# EasyEDA Pro project STM32_JBL_02.eprj

# Schematic STM32F103C8T6
Create Date: 2024-06-13; Page Name: P1; Project Name: STM32_JBL_02; Schematic Name: STM32F103C8T6; Update Date: 2024-09-14; Company: 帮帮邦邦; Drawed: 电子1214邱振邦; Page Size: A4; Reviewed: 电子1214罗杰华; Version: V1.1
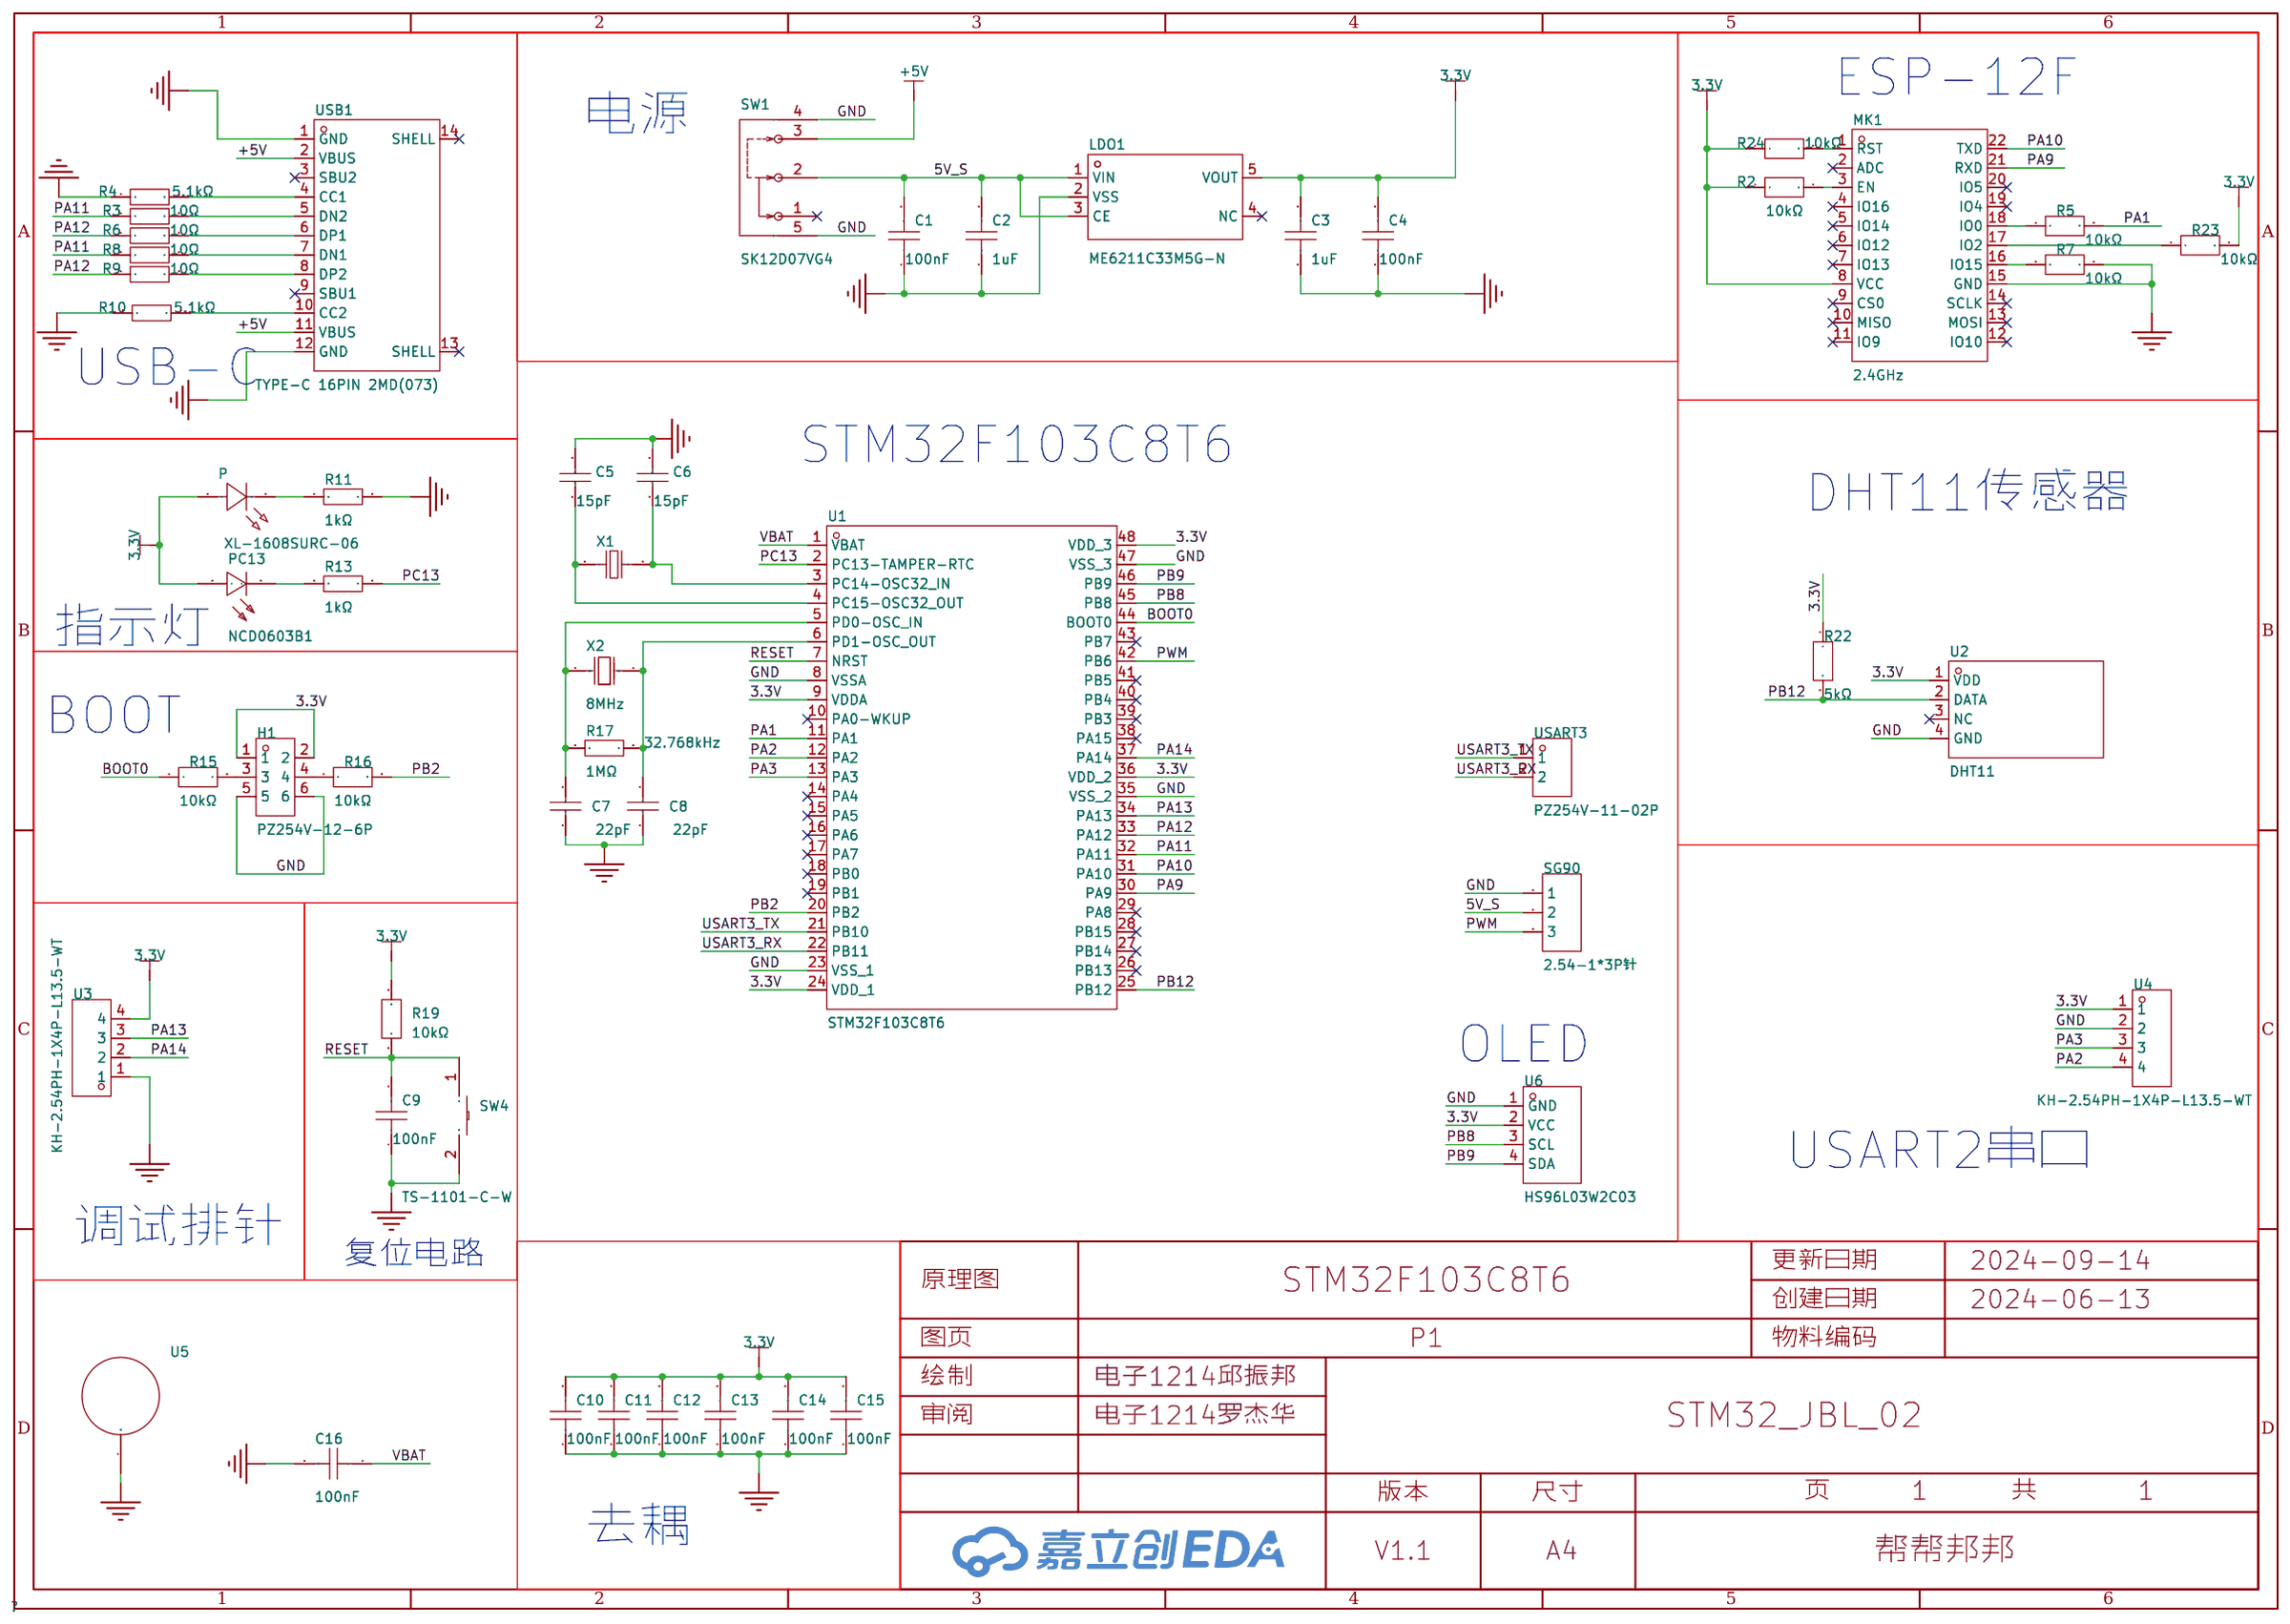
[diagram p0: schematic sheet]

## Parts
C1  100nF  [C0603]
C2  1uF  [C0603]
C3  1uF  [C0603]
C4  100nF  [C0603]
C5  15pF  [C0603]
C6  15pF  [C0603]
C7  22pF  [C0603]
C8  22pF  [C0603]
C9  100nF  [C0603]
C10  100nF  [C0603]
C11  100nF  [C0603]
C12  100nF  [C0603]
C13  100nF  [C0603]
C14  100nF  [C0603]
C15  100nF  [C0603]
C16  100nF  [C0603]
H1  PZ254V-12-6P  [HDR-TH_6P-P2.54-V-M-R2-C3-S2.54]
LDO1  ME6211C33M5G-N  [SOT-23-5_L3.0-W1.7-P0.95-LS2.8-BL]
MK1  2.4GHz  [WIFIM-SMD_ESP-12E-BR]
P  XL-1608SURC-06  [LED0603-RD_RED]
PC13  NCD0603B1  [LED0603-RD]
R2  10kΩ  [R0603]
R3  10Ω  [R0603]
R4  5.1kΩ  [R0603]
R5  10kΩ  [R0603]
R6  10Ω  [R0603]
R7  10kΩ  [R0603]
R8  10Ω  [R0603]
R9  10Ω  [R0603]
R10  5.1kΩ  [R0603]
R11  1kΩ  [R0603]
R13  1kΩ  [R0603]
R15  10kΩ  [R0603]
R16  10kΩ  [R0603]
R17  1MΩ  [R0603]
R19  10kΩ  [R0603]
R22  5kΩ  [R0805]
R23  10kΩ  [R0603]
R24  10kΩ  [R0603]
SG90  2.54-1*3P针  [HDR-TH_3P-P2.54-V-M-1]
SW1  SK12D07VG4  [SW-TH_SK12D07VG4]
SW4  TS-1101-C-W  [SW-SMD_L6.0-W3.3-LS8.0]
U1  STM32F103C8T6  [LQFP-48_L7.0-W7.0-P0.50-LS9.0-BL]
U2  DHT11  [SENSOR-TH_DHT11]
U3  KH-2.54PH-1X4P-L13.5-WT  [HDR-SMD_4P-P2.54-H-M-W13.3-N]
U4  KH-2.54PH-1X4P-L13.5-WT  [HDR-SMD_4P-P2.54-H-M-W13.3-N]
U5  -  [定位孔]
U6  HS96L03W2C03  [OLED-TH_L27.8-W27.2-P2.54_C9900033791]
USART3  PZ254V-11-02P  [HDR-TH_2P-P2.54-V-M]
USB1  TYPE-C 16PIN 2MD(073)  [USB-C-SMD_TYPE-C-6PIN-2MD-073]
X1  32.768kHz  [FC-135R_L3.2-W1.5]
X2  8MHz  [CRYSTAL-SMD_L11.5-W4.8-LS12.7]

## Library data of the parts
C1 C4 C9-C16 = CC0603KRX7R9BB104: 容值:100nF;精度:±10%;额定电压:50V;材质(温度系数):X7R;; LCSC Part Name: 100nF ±10% 50V; Supplier Part: C14663; Manufacturer: YAGEO(国巨); Supplier Footprint: 0603; JLCPCB Part Class: Basic Part; Datasheet: https://atta.szlcsc.com/upload/public/pdf/source/20180910/C282072_33301C7F631E79921B82A8DAC6BCC5B3.pdf; Supplier: LCSC; Tolerance: ±10%; Voltage Rated: 50V; Temperature Coefficient: X7R
C2 C3 = CL10A105KB8NNNC: 容值:1uF;精度:±10%;额定电压:50V;材质(温度系数):X5R;; LCSC Part Name: 1uF ±10% 50V; Supplier Part: C15849; Manufacturer: SAMSUNG(三星); Supplier Footprint: 0603; JLCPCB Part Class: Basic Part; Datasheet: https://atta.szlcsc.com/upload/public/pdf/source/20160218/1457707763339.pdf; Supplier: LCSC; Tolerance: ±10%; Voltage Rated: 50V; Temperature Coefficient: X5R
C5 C6 = CL10C150JB8NNNC: 容值:15pF;精度:±5%;额定电压:50V;材质(温度系数):C0G;; LCSC Part Name: 15pF ±5% 50V; Supplier Part: C1644; Manufacturer: SAMSUNG(三星); Supplier Footprint: 0603; JLCPCB Part Class: Basic Part; Datasheet: https://atta.szlcsc.com/upload/public/pdf/source/20160218/1457707763339.pdf; Supplier: LCSC; Tolerance: ±5%; Voltage Rated: 50V; Temperature Coefficient: C0G
C7 C8 = CC0603JRNPO9BN220: 容值:22pF;精度:±5%;额定电压:50V;材质(温度系数):NP0;; LCSC Part Name: 22pF ±5% 50V; Supplier Part: C105620; Manufacturer: YAGEO(国巨); Supplier Footprint: 0603; JLCPCB Part Class: Extended Part; Datasheet: https://atta.szlcsc.com/upload/public/pdf/source/20170505/1493957838062.pdf; Supplier: LCSC; Tolerance: ±5%; Voltage Rated: 50V; Temperature Coefficient: NP0
H1 = PZ254V-12-6P: 插针结构:2x3P;间距:2.54mm;行距:2.54mm;圆针/方针:方针;安装类型:直插;排数:双排;总PIN位数:6P;额定电流:-;额定电压:-;配合针长度:6mm;塑高:2.5mm;端接针长度:3mm;触头材质:黄铜;触头镀层:-;工作温度范围:-40℃~+105℃;颜色:黑色;; LCSC Part Name: 间距:2.54mm 2x3P 直插 方针; Supplier Part: C492420; Manufacturer: XFCN(兴飞); Supplier Footprint: 插件,P=2.54mm; JLCPCB Part Class: Extended Part; Datasheet: https://atta.szlcsc.com/upload/public/pdf/source/20200309/C492420_BAECB307B001054C09D200388220EAE6.pdf; Supplier: LCSC; Pin Structure: 2x3P; Pitch: 2.54mm; Row Spacing: 2.54mm; Circluar Pins/Square Pins: 方针; Mounting Type: 直插; Number of Rows: 双排; Number of Pins: 6P; Length of Mating Pin: 6mm; Insulation Height: 2.5mm; Length of End Connection Pin: 3mm; Contact Material: 黄铜; Operating Temperature Range: -40℃~+105℃; Color: 黑色
LDO1 = ME6211C33M5G-N: 输出类型:固定;最大输入电压:6V;输出电压:3.3V;最大输出电流:500mA;电源纹波抑制比(PSRR):70dB;输出极性:正极;; LCSC Part Name: 输入6V 输出3.3V 500mA; Supplier Part: C82942; Manufacturer: MICRONE(南京微盟); Supplier Footprint: SOT-23-5; JLCPCB Part Class: Extended Part; Datasheet: https://atta.szlcsc.com/upload/public/pdf/source/20170918/C82942_1505727073070976520.pdf; Supplier: LCSC; Output Type: 固定; Maximum Input Voltage: 6V; Output Voltage: 3.3V; MAX Output Current: 500mA; Power Supply Rejection Ratio (PSRR): 70dB; Dropout Voltage: 260mV@(200mA); Output Polarity: 正极; Number of Outputs: 1
MK1 = ESP-12E_C89297: 核心处理器:ESP8266芯片;频率:2.4GHz;天线形式:板载PCB天线;发射功率:16dBm;接收灵敏度:-90dBm;; LCSC Part Name: 完整的802.11b/g/nWi-FiSoC模块; Supplier Part: C89297; Manufacturer: Ai-Thinker(安信可); Manufacturer Part: ESP-12E; Supplier Footprint: SMD,16x24mm; JLCPCB Part Class: Extended Part; Datasheet: https://atta.szlcsc.com/upload/public/pdf/source/20200309/C89297_977B32CC0B44EF42A21CAAFB43B2575A.pdf; Supplier: LCSC; Core Processor: ESP8266芯片; Support Interface: GPIO；UART；I2C；PWM；SPI；ADC; Antenna Type: 板载PCB天线; Output Power: 16dBm; Operating Voltage: 3V~3.6V; Receive  Current: 56mA; Send  Current: 170mA; Sensitivity: -90dBm; Operating Temperature: -20℃~+70℃
P = XL-1608SURC-06: 发光颜色:红色;功率:55mW;正向电流:25mA;主波长:617nm~621nm;透镜颜色:无色透明透镜;色温:-;发光角度:120°;载带方式:正贴;工作温度:-30℃~+85℃;; Supplier Part: C965799; Manufacturer: XINGLIGHT(成兴光); Supplier Footprint: 0603; JLCPCB Part Class: Extended Part; Datasheet: https://atta.szlcsc.com/upload/public/pdf/source/20221102/D860AFDD1CDB02C5A8064103A32707E2.pdf; Supplier: LCSC; Emitted Color: 红色; Power Dissipation: 55mW; Forward Current: 25mA; Dominant Wavelength: 617nm~621nm; Peak Wavelength: 623nm; Lens Color: 无色透明透镜; Viewing Angle: 120°; Mounting Sytle: 正贴; Operating Temperature: -30℃~+85℃
PC13 = NCD0603B1: 发光颜色:蓝色;正向电压(VF):2.6V~3.6V;功率:72mW;正向电流:10mA;主波长:463nm~475nm;透镜颜色:无色透明透镜;发光强度:80mcd~220mcd;发光角度:130°;工作温度:-30℃~+85℃;; Supplier Part: C84266; Manufacturer: 国星光电; Supplier Footprint: 0603; JLCPCB Part Class: 扩展库; Datasheet: https://atta.szlcsc.com/upload/public/pdf/source/20200820/C84266_6A3CDBEFA72C6CAD68EDA53474ADAE6C.pdf; Supplier: LCSC; Emitted Color: 蓝色; Forward Voltage (VF): 2.6V~3.6V; Power Dissipation: 72mW; Forward Current: 10mA; Dominant Wavelength: 463nm~475nm; Lens Color: 无色透明透镜; Luminous Intensity: 80mcd~220mcd; Viewing Angle: 130°; Operating Temperature: -30℃~+85℃
R2 R5 R7 R15 R16 R19 R23 R24 = FRC0603J103TS: 电阻类型:厚膜电阻;阻值:10kΩ;精度:±5%;功率:100mW;最大工作电压:75V;温度系数:±100ppm/℃;; LCSC Part Name: 10kΩ ±5% 100mW 厚膜电阻; Supplier Part: C2930027; Manufacturer: FOJAN(富捷); Supplier Footprint: 0603; JLCPCB Part Class: Extended Part; Datasheet: https://atta.szlcsc.com/upload/public/pdf/source/20211221/925EC7D7225764EE0046F22065062C87.pdf; Supplier: LCSC; Type: 厚膜电阻; Tolerance: ±5%; Power(Watts): 100mW; Overload Voltage (Max): 75V; Temperature Coefficient: ±100ppm/℃; Operating Temperature Range: -55℃~+155℃
R3 R6 R8 R9 = 0603WAF100JT5E: 电阻类型:厚膜电阻;阻值:10Ω;精度:±1%;功率:100mW;最大工作电压:75V;温度系数:±400ppm/℃;; LCSC Part Name: 10Ω ±1% 100mW 厚膜电阻; Supplier Part: C22859; Manufacturer: UNI-ROYAL(厚声); Supplier Footprint: 0603; JLCPCB Part Class: Basic Part; Datasheet: https://atta.szlcsc.com/upload/public/pdf/source/20200306/C422600_1E6D84923E4A46A82E41ADD87F860B5C.pdf; Supplier: LCSC; Type: 厚膜电阻; Tolerance: ±1%; Power(Watts): 100mW; Overload Voltage (Max): 75V; Temperature Coefficient: ±400ppm/℃; Operating Temperature Range: -55℃~+155℃
R4 R10 = 0603WAF5101T5E: 电阻类型:厚膜电阻;阻值:5.1kΩ;精度:±1%;功率:100mW;最大工作电压:75V;温度系数:±100ppm/℃;; LCSC Part Name: 5.1kΩ ±1% 100mW 厚膜电阻; Supplier Part: C23186; Manufacturer: UNI-ROYAL(厚声); Supplier Footprint: 0603; JLCPCB Part Class: Basic Part; Datasheet: https://atta.szlcsc.com/upload/public/pdf/source/20200306/C422600_1E6D84923E4A46A82E41ADD87F860B5C.pdf; Supplier: LCSC; Type: 厚膜电阻; Tolerance: ±1%; Power(Watts): 100mW; Overload Voltage (Max): 75V; Temperature Coefficient: ±100ppm/℃; Operating Temperature Range: -55℃~+155℃
R11 R13 = RC0603FR-071KL: 电阻类型:厚膜电阻;阻值:1kΩ;精度:±1%;功率:100mW;最大工作电压:75V;温度系数:±100ppm/℃;; LCSC Part Name: 厚膜电阻 1kΩ ±1% 100mW; Supplier Part: C22548; Manufacturer: YAGEO(国巨); Supplier Footprint: 0603; JLCPCB Part Class: Extended Part; Datasheet: https://atta.szlcsc.com/upload/public/pdf/source/20180316/70C0E2BDAE7FCC62C531A5A58D202EE1.pdf; Supplier: LCSC; Type: 厚膜电阻; Tolerance: ±1%; Power(Watts): 100mW; Overload Voltage (Max): 75V; Temperature Coefficient: ±100ppm/℃; Operating Temperature Range: -55℃~+155℃
R17 = 0603WAF1004T5E: 电阻类型:厚膜电阻;阻值:1MΩ;精度:±1%;功率:100mW;最大工作电压:75V;温度系数:±100ppm/℃;; LCSC Part Name: 1MΩ ±1% 100mW 厚膜电阻; Supplier Part: C22935; Manufacturer: UNI-ROYAL(厚声); Supplier Footprint: 0603; JLCPCB Part Class: Basic Part; Datasheet: https://atta.szlcsc.com/upload/public/pdf/source/20200306/C422600_1E6D84923E4A46A82E41ADD87F860B5C.pdf; Supplier: LCSC; Type: 厚膜电阻; Tolerance: ±1%; Power(Watts): 100mW; Overload Voltage (Max): 75V; Temperature Coefficient: ±100ppm/℃; Operating Temperature Range: -55℃~+155℃
R22 = ARG05BTC5001N: 电阻类型:薄膜电阻;阻值:5kΩ;精度:±0.1%;功率:125mW;最大工作电压:150V;温度系数:±25ppm/℃;; LCSC Part Name: 薄膜电阻 5kΩ ±0.1% 125mW; Supplier Part: C2828700; Manufacturer: Viking(光颉); Supplier Footprint: 0805; JLCPCB Part Class: Extended Part; Datasheet: https://atta.szlcsc.com/upload/public/pdf/source/20190816/C412422_E173BA386C6DD8245B6A88358EF9877A.pdf; Supplier: LCSC; Type: 薄膜电阻; Tolerance: ±0.1%; Power(Watts): 125mW; Overload Voltage (Max): 150V; Temperature Coefficient: ±25ppm/℃; Operating Temperature Range: -55℃~+155℃
SG90 = 2.54-1*3P针: 插针结构:1x3P;间距:2.54mm;行距:-;圆针/方针:方针;安装类型:直插;排数:单排;总PIN位数:3P;额定电流:3A;额定电压:-;配合针长度:-;塑高:-;端接针长度:-;触头材质:-;触头镀层:-;工作温度范围:-40℃~+105℃;颜色:黑色;; LCSC Part Name: 间距:2.54mm 1x3P 直插 方针; Supplier Part: C49257; Manufacturer: BOOMELE(博穆精密); Supplier Footprint: 插件,P=2.54mm; JLCPCB Part Class: 扩展库; Datasheet: https://atta.szlcsc.com/upload/public/pdf/source/20221018/3E9408392E35E6F57A28985E5F7BF5C9.pdf; Supplier: LCSC; Pin Structure: 1x3P; Pitch: 2.54mm; Circluar Pins/Square Pins: 方针; Mounting Type: 直插; Number of Rows: 单排; Number of Pins: 3P; Current Rating (Max): 3A; Operating Temperature Range: -40℃~+105℃; Color: 黑色
SW1 = SK12D07VG4: 电路结构:单刀双掷;安装方式:-;额定电流(DC):500mA;额定电压(DC):50V;额定电流(AC):-;额定电压(AC):-;机械寿命:5千次;; LCSC Part Name: 3脚2档位 卧插 滑动开关; Supplier Part: C393937; Manufacturer: SHOU HAN(首韩); Supplier Footprint: 插件; JLCPCB Part Class: Extended Part; Datasheet: https://atta.szlcsc.com/upload/public/pdf/source/20190521/C393937_939FE26E571CC67D2D532E953108A1B0.pdf; Supplier: LCSC; Circuit: 单刀双掷; Actuator Style: 矩形柱状; Pin Style: PC引脚; Switch Height: 8.8mm; Current Rating (DC): 500mA; Voltage Rating (DC): 50V; Mechanical Life: 5千次
SW4 = TS-1101-C-W: 电路结构:单刀单掷;按钮形状:矩形按钮;作用力:260gf;安装方式:立贴;开关长度:6mm;开关宽度:3.6mm;开关高度:2.5mm;带支架:不带;触点电流:50mA;额定电压(AC):-;额定电压(DC):12V;额定功率:-;绝缘电阻:-;带灯:无;机械寿命:5万次;; LCSC Part Name: 6*3.6*2.5mm 立贴 轻触开关; Supplier Part: C318938; Manufacturer: XKB Connectivity(中国星坤); Supplier Footprint: SMD; JLCPCB Part Class: Extended Part; Datasheet: https://atta.szlcsc.com/upload/public/pdf/source/20200227/C318938_C2E53B1EEDE37D980A33616AC086DE53.pdf; Supplier: LCSC; Circuit: 单刀单掷; Actuator Style: 矩形按钮; Operating Force: 260gf; Mounting Style: 立贴; Switch Length: 6mm; Switch Width: 3.6mm; Switch Height: 2.5mm; Strike Gundam: 不带; Contact Current: 50mA; Voltage Rating (DC): 12V; Actuator/Cap Color: 白色带淡绿; With Lamp: 无; Mechanical Life: 5万次; Operating Temperature: -30℃~+85℃
U1 = STM32F103C8T6: CPU内核:ARM-M3;程序存储容量:64KB;RAM总容量:20KB;GPIO端口数量:37;工作电压范围:2V~3.6V;CPU最大主频:72MHz;程序存储器类型:FLASH;; Supplier Part: C8734; Manufacturer: ST(意法半导体); Supplier Footprint: LQFP-48(7x7); JLCPCB Part Class: Extended Part; Datasheet: https://atta.szlcsc.com/upload/public/pdf/source/20220812/8363ACEC51AD55ECEB84799464F7CB85.pdf; Supplier: LCSC; CPU Core: ARM-M3; Program Storage Size: 64KB; RAM Size: 20KB; GPIO Ports Number: 37; Operating Voltage Range: 2V~3.6V; CPU Maximum Speed: 72MHz; Program Memory Type: FLASH; Operating Temperature Range: -40℃~+85℃; ADC (Bit): 12bit; Universal Serial Bus: 有; Peripheral/Function: 看门狗；DMA；看门狗；温度传感器; Watchdog: 有; Infrared Data Association: 有; Low-Voltage Detect: 有; Direct Memory Access: 有; Internal Oscillator: 有
U2 = DHT11: 新款电容式数字温湿度传感器,老款已停产16.1x12.6x5.8mm; LCSC Part Name: DHT11  电容式传感器; Supplier Part: C117051; Manufacturer: 广州奥松; Supplier Footprint: SIP-4; JLCPCB Part Class: Extended Part; Datasheet: https://atta.szlcsc.com/upload/public/pdf/source/20170703/1499081238365.pdf; Supplier: LCSC
U3 U4 = KH-2.54PH-1X4P-L13.5-WT: 插针结构:1x4P;间距:2.54mm;安装类型:卧贴;排数:单排;; LCSC Part Name: 1x4P 间距:2.54mm 卧贴; Supplier Part: C20610213; Manufacturer: kinghelm(金航标); Supplier Footprint: SMD,P=2.54mm,卧贴; JLCPCB Part Class: Extended Part; Datasheet: https://atta.szlcsc.com/upload/public/pdf/source/20240117/0E03F58DBD0D2B730423A71148A2974D.pdf; Supplier: LCSC; Pin Structure: 1x4P; Pitch: 2.54mm; Mounting Type: 卧贴; Number of Rows: 单排
U5 = 定位孔
U6 = HS96L03W2C03: 主控芯片:SSD1315;接口类型:I2C;尺寸(inch):0.96;像素分辨率:128x64;; LCSC Part Name: 0.96寸OLED显示屏窄白光IIC; Supplier Part: C5248080; Manufacturer: HS(汉昇); JLCPCB Part Class: 扩展库; Datasheet: https://atta.szlcsc.com/upload/public/pdf/source/20230627/763D01F79A90007632F098068C7C8AD9.pdf; Supplier: LCSC; Main Control Chip: SSD1315; Interface Type: I2C; Size: 0.96; Pixel Resolution: 128x64; Operating Temperature: -40℃~+70℃
USART3 = PZ254V-11-02P: 插针结构:1x2P;间距:2.54mm;行距:-;圆针/方针:方针;安装类型:直插;排数:单排;总PIN位数:2P;额定电流:-;额定电压:-;配合针长度:6mm;塑高:2.5mm;端接针长度:3mm;触头材质:黄铜;触头镀层:-;工作温度范围:-40℃~+105℃;颜色:黑色;; LCSC Part Name: 间距:2.54mm 1x2P 直插 方针; Supplier Part: C492401; Manufacturer: XFCN(兴飞); Supplier Footprint: 插件,P=2.54mm; JLCPCB Part Class: 扩展库; Datasheet: https://atta.szlcsc.com/upload/public/pdf/source/20200309/C492401_A812433581A9B211A7FFA413ADDFF0E5.pdf; Supplier: LCSC; Pin Structure: 1x2P; Pitch: 2.54mm; Circluar Pins/Square Pins: 方针; Mounting Type: 直插; Number of Rows: 单排; Number of Pins: 2P; Length of Mating Pin: 6mm; Insulation Height: 2.5mm; Length of End Connection Pin: 3mm; Contact Material: 黄铜; Operating Temperature Range: -40℃~+105℃; Color: 黑色
USB1 = TYPE-C 16PIN 2MD(073): 连接器类型:Type-C;标准:-;公母:母;端口数量:1;触点数量:16P;安装方式:卧贴;额定电流 - 电源:5A;工作温度范围:-25℃~+85℃;; LCSC Part Name: Type-C 母 卧贴; Supplier Part: C2765186; Manufacturer: SHOU HAN(首韩); Supplier Footprint: SMD; JLCPCB Part Class: Extended Part; Datasheet: https://atta.szlcsc.com/upload/public/pdf/source/20211123/39B17C16241EAC15C5E277BDA434118E.pdf; Supplier: LCSC; Connector Type: Type-C; Gender: 母; Number of Ports: 1; Number of Contacts: 16P; Mounting Style: 卧贴; Current Rating - Power (Max): 5A; Operating Temperature Range: -25℃~+85℃
X1 = Q13FC13500004_C32346: 晶振类型:贴片晶振;频率:32.768kHz;常温频差:±20ppm;外接负载电容:12.5pF;; LCSC Part Name: 32.768kHz ±20ppm 12.5pF; Supplier Part: C32346; Manufacturer: EPSON(爱普生); Manufacturer Part: Q13FC13500004; Supplier Footprint: SMD3215-2P; JLCPCB Part Class: Basic Part; Datasheet: https://atta.szlcsc.com/upload/public/pdf/source/20240418/0E0FF5F0356BA3753F616001439D1416.pdf; Supplier: LCSC; Crystal Type: 贴片晶振; Normal temperature Frequency Tolerance: ±20ppm; External load capacitor: 12.5pF; Equivalent Series Resistance (ESR): 70kΩ; Operating Temperature: -40℃~+85℃
X2 = X49SM8MSD2SC: 晶振类型:贴片晶振;频率:8MHz;常温频差:±20ppm;外接负载电容:20pF;频率稳定度(全温):±30ppm;; LCSC Part Name: 8MHz ±20ppm 20pF; Supplier Part: C12674; Manufacturer: YXC(扬兴晶振); Supplier Footprint: HC-49S-SMD; JLCPCB Part Class: Basic Part; Datasheet: https://atta.szlcsc.com/upload/public/pdf/source/20240329/3EBF42EBCAB50CA65B6FA9D7CFA1955A.pdf; Supplier: LCSC; Crystal Type: 贴片晶振; Normal temperature Frequency Tolerance: ±20ppm; External load capacitor: 20pF; Frequency Stability(Full temperature range): ±30ppm; Operating Temperature: -20℃~+70℃

## Nets
3.3V: C3.2 C4.2 C10.2 C11.2 C12.2 C13.2 C14.2 C15.2 H1.1 H1.2 LDO1.5(VOUT) MK1.8(VCC) P.2(A) PC13.2(+) R2.1 R19.2 R22.1 R23.2 R24.1 U1.9(VDDA) U1.24(VDD_1) U1.36(VDD_2) U1.48(VDD_3) U2.1(VDD) U3.4 U4.1 U6.2(VCC)
5V_S: C1.2 C2.2 LDO1.1(VIN) LDO1.3(CE) SG90.2 SW1.2
+5V: SW1.3 USB1.2(VBUS) USB1.11(VBUS)
GND: C1.1 C2.1 C3.1 C4.1 C5.2 C6.2 C7.1 C8.1 C9.1 C10.1 C11.1 C12.1 C13.1 C14.1 C15.1 C16.2 H1.5 H1.6 LDO1.2(VSS) MK1.15(GND) R4.1 R7.2 R10.1 R11.2 SG90.1 SW1.4 SW1.5 SW4.2 U1.8(VSSA) U1.23(VSS_1) U1.35(VSS_2) U1.47(VSS_3) U2.4(GND) U3.1 U4.2 U5.1(GND) U6.1(GND) USB1.1(GND) USB1.12(GND)
VBAT: C16.1 U1.1(VBAT)
BOOT0: R15.1 U1.44(BOOT0)
PA1: R5.2 U1.11(PA1)
PA2: U1.12(PA2) U4.4
PA3: U1.13(PA3) U4.3
PA9: MK1.21(RXD) U1.30(PA9)
PA10: MK1.22(TXD) U1.31(PA10)
PA11: R3.1 R8.1 U1.32(PA11)
PA12: R6.1 R9.1 U1.33(PA12)
PA13: U1.34(PA13) U3.3
PA14: U1.37(PA14) U3.2
PB2: R16.2 U1.20(PB2)
PB8: U1.45(PB8) U6.3(SCL)
PB9: U1.46(PB9) U6.4(SDA)
PB12: R22.2 U1.25(PB12) U2.2(DATA)
PC13: R13.2 U1.2(PC13-TAMPER-RTC)
PWM: SG90.3 U1.42(PB6)
RESET: C9.2 R19.1 SW4.1 U1.7(NRST)
USART3_RX: U1.22(PB11) USART3.2
USART3_TX: U1.21(PB10) USART3.1
$1N1630: MK1.3(EN) R2.2
$1N3315: C5.1 U1.4(PC15-OSC32_OUT) X1.2
$1N3359: C6.1 U1.3(PC14-OSC32_IN) X1.1
$1N3671: C7.2 R17.1 U1.5(PD0-OSC_IN) X2.1(OSC1)
$1N3708: C8.2 R17.2 U1.6(PD1-OSC_OUT) X2.2(OSC2)
$1N7553: R3.2 USB1.5(DN2)
$1N7577: R6.2 USB1.6(DP1)
$1N7601: R8.2 USB1.7(DN1)
$1N7625: R9.2 USB1.8(DP2)
$1N15087: P.1(K) R11.1
$1N15121: PC13.1(-) R13.1
$1N18837: R10.2 USB1.10(CC2)
$1N26698: MK1.16(IO15) R7.1
$1N35712: R4.2 USB1.4(CC1)
$1N52179: MK1.18(IO0) R5.1
$1N52203: MK1.17(IO2) R23.1
$1N63834: MK1.1(RST) R24.2
$1N65356: H1.4 R16.1
$1N65358: H1.3 R15.2

Not connected (* = marked no-connect by the designer): LDO1 4(NC)*; MK1 2(ADC)* 4(IO16)* 5(IO14)* 6(IO12)* 7(IO13)* 9(CS0)* 10(MISO)* 11(IO9)* 12(IO10)* 13(MOSI)* 14(SCLK)* 19(IO4)* 20(IO5)*; SW1 1*; U1 10(PA0-WKUP)* 14(PA4)* 15(PA5)* 16(PA6)* 17(PA7)* 18(PB0)* 19(PB1)* 26(PB13)* 27(PB14)* 28(PB15)* 29(PA8)* 38(PA15)* 39(PB3)* 40(PB4)* 41(PB5)* 43(PB7)*; U2 3(NC)*; USB1 3(SBU2)* 9(SBU1)* 13(SHELL)* 14(SHELL)*

## Notes on the sheet
- ESP-12F
- 电源
- USB-C
- STM32F103C8T6
- DHT11传感器
- 指示灯
- BOOT
- OLED
- USART2串口
- 调试排针
- 复位电路
- 去耦

# Board PCB2
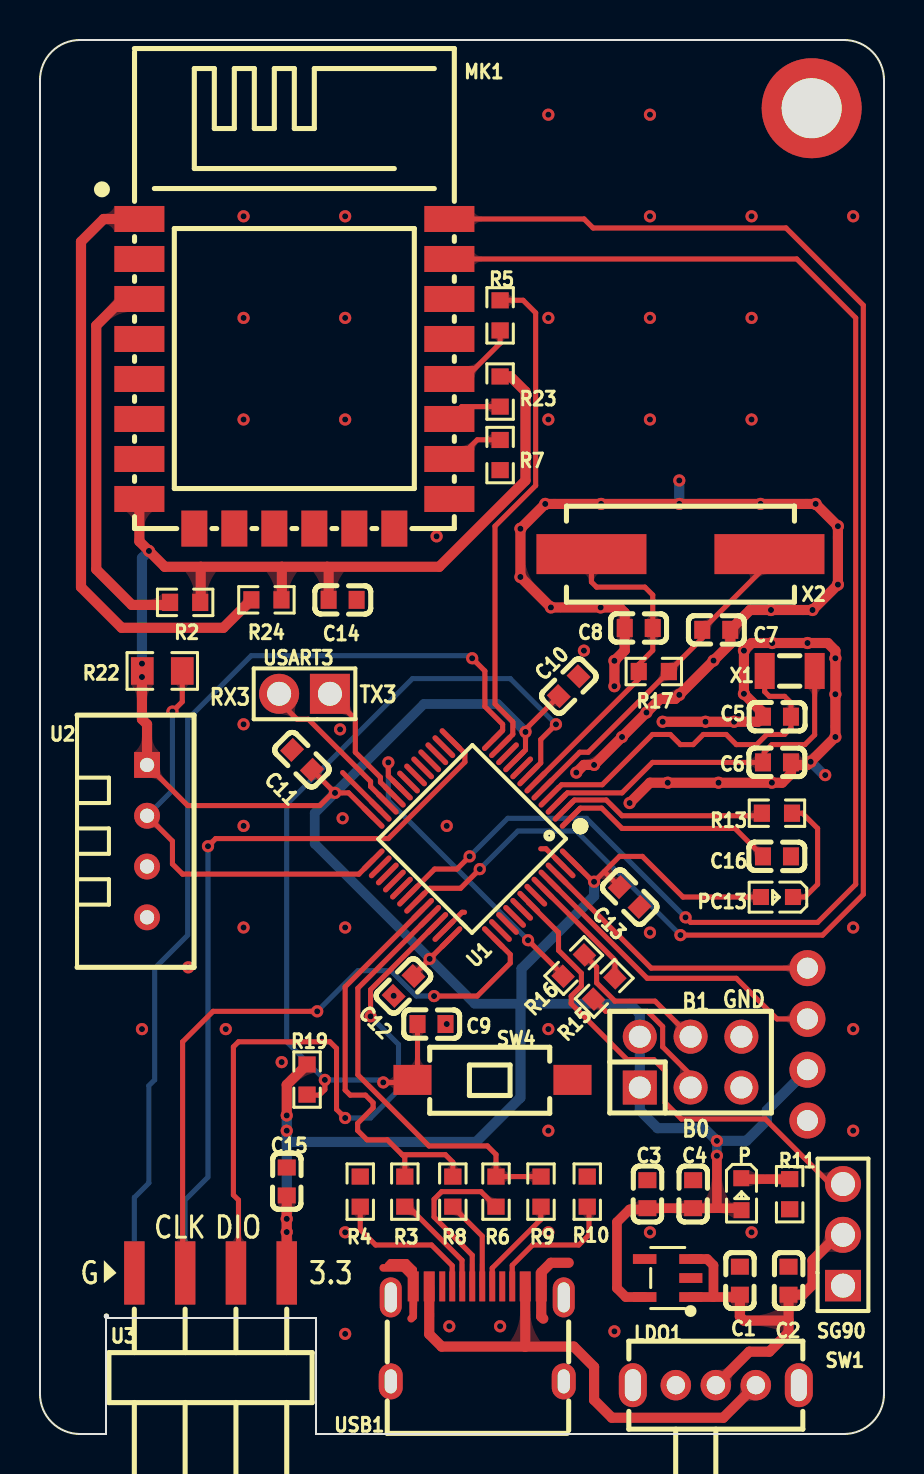
[diagram p1: board, top side]
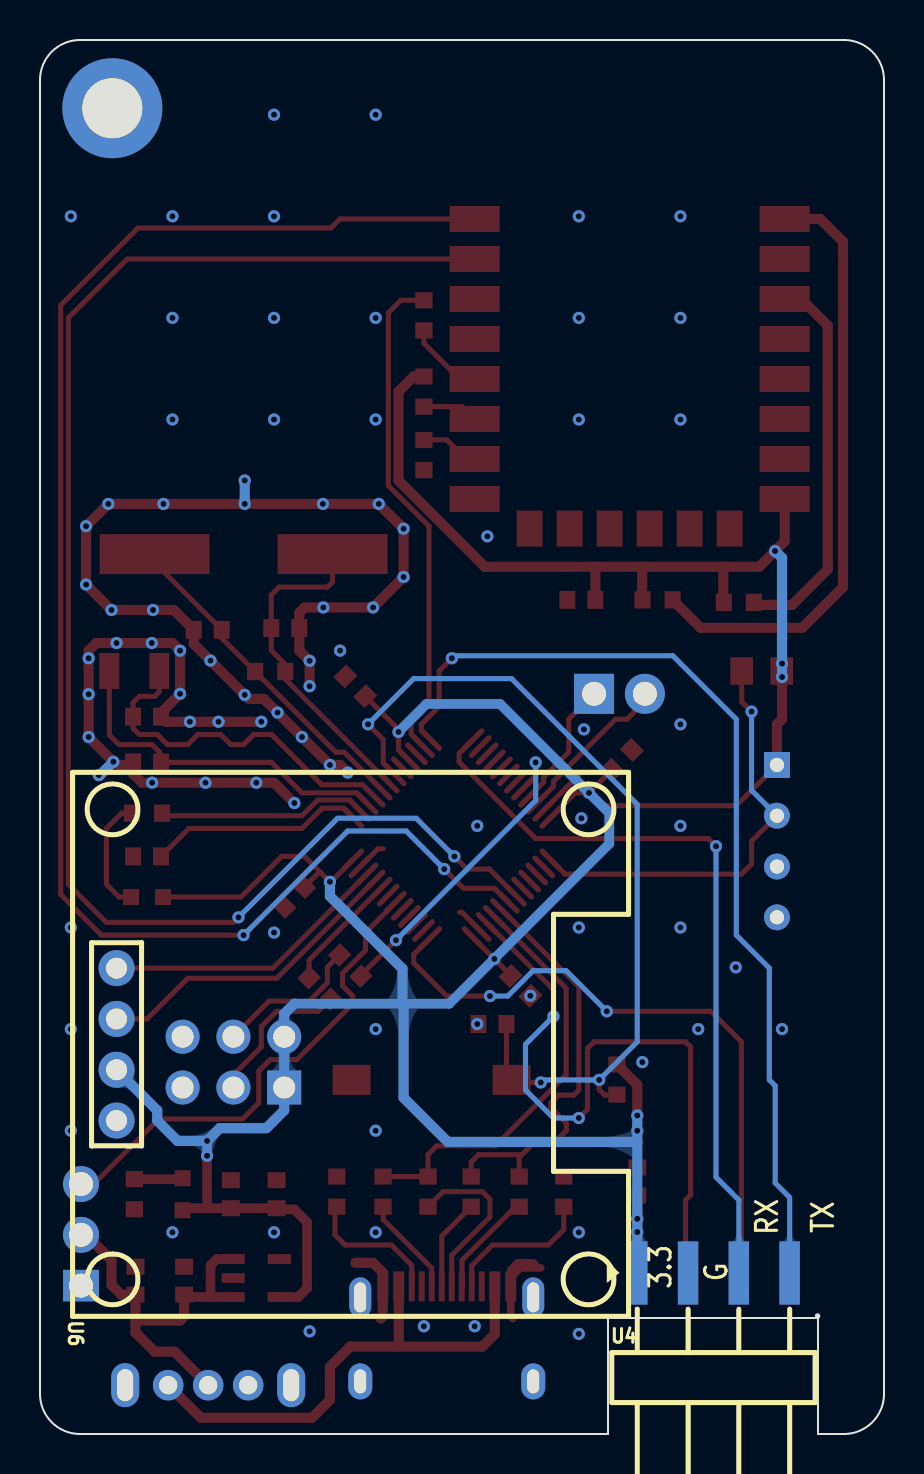
[diagram p2: board, bottom side, seen from below]

Outline 42.2 x 69.7 mm; copper layers: Top Layer, Bottom Layer. Coordinates in mm from the lower left corner of the outline.
Outline path: 3.3,2 3.3,0 ; 3.3,0 2,0 arc(0.59,0.59) 0,2 0,67.7 arc(0.59,69.11) 2,69.7 40.2,69.7 arc(41.61,69.11) 42.2,67.7 42.2,2 arc(41.61,0.59) 40.2,0 13.8,0 ; 3.3,0 3.3,5.8 13.8,5.8 13.8,0 ; 13.8,0 13.8,2 ; 3.32,5.89 3.32,5.89 3.33,5.89 3.32,5.89
Stack: Top Layer 0.035mm / Dielectric1 1.51mm FR4 er 4.5 / Bottom Layer 0.035mm

## Design rules (mm)
template: JLCPCB Capability(Two Layers Board)
spacing copperThickness1oz (default): track to track 0.102, other pairs 0.152 to 0.3
spacing copperThickness2oz: track to track 0.203, other pairs 0.152 to 0.3
track width copperThickness1oz (default): min 0.127, default 0.254, max 2.54
track width copperThickness2oz: min 0.203, default 0.254, max 2.54
differential pair differentialPair (default): width min 0.127, default 0.254, max 2.54; gap min 0.152, default 0.152
via viaSize (default): diameter min 0.5, default 0.61, max 10; hole min 0.3, default 0.305, max 6.3

## Placement (name value [footprint] x y rotation side)
C1  100nF  [C0603]  34.99 7.66 270 top
C2  1uF  [C0603]  37.43 7.66 270 top
C3  1uF  [C0603]  30.37 11.99 270 top
C4  100nF  [C0603]  32.66 11.99 270 top
C5  15pF  [C0603]  36.85 35.87 180 top
C6  15pF  [C0603]  36.85 33.58 0 top
C7  22pF  [C0603]  33.81 40.21 180 top
C8  22pF  [C0603]  29.94 40.3 0 top
C9  100nF  [C0603]  19.58 20.5 180 top
C10  100nF  [C0603]  26.43 37.39 225 top
C11  100nF  [C0603]  13.1 33.71 315 top
C12  100nF  [C0603]  18.18 22.4 45 top
C13  100nF  [C0603]  29.48 26.85 135 top
C14  100nF  [C0603]  15.13 41.71 180 top
C15  100nF  [C0603]  12.34 12.62 270 top
C16  100nF  [C0603]  36.85 28.88 0 top
H1  PZ254V-12-6P  [HDR-TH_6P-P2.54-V-M-R2-C3-S2.54]  32.53 18.59 0 top
LDO1  ME6211C33M5G-N  [SOT-23-5_L3.0-W1.7-P0.95-LS2.8-BL]  31.39 7.8 90 top
MK1  2.4GHz  [WIFIM-SMD_ESP-12E-BR]  12.72 53.01 270 top
P  XL-1608SURC-06  [LED0603-RD_RED]  35.07 11.99 270 top
PC13  NCD0603B1  [LED0603-RD]  36.85 26.85 180 top
R2  10kΩ  [R0603]  7.26 41.58 180 top
R3  10Ω  [R0603]  18.24 12.12 270 top
R4  5.1kΩ  [R0603]  16.01 12.12 270 top
R5  10kΩ  [R0603]  23 55.93 90 top
R6  10Ω  [R0603]  22.8 12.12 270 top
R7  10kΩ  [R0603]  23 48.95 270 top
R8  10Ω  [R0603]  20.64 12.12 270 top
R9  10Ω  [R0603]  25.05 12.12 270 top
R10  5.1kΩ  [R0603]  27.36 12.12 270 top
R11  1kΩ  [R0603]  37.48 11.99 270 top
R13  1kΩ  [R0603]  36.85 31.04 180 top
R15  10kΩ  [R0603]  28.21 22.28 225 top
R16  10kΩ  [R0603]  26.69 23.42 225 top
R17  1MΩ  [R0603]  30.69 38.12 180 top
R19  10kΩ  [R0603]  13.35 17.72 90 top
R22  5kΩ  [R0805]  6.11 38.15 0 top
R23  10kΩ  [R0603]  23 52.12 90 top
R24  10kΩ  [R0603]  11.32 41.71 180 top
SG90  2.54-1*3P针  [HDR-TH_3P-P2.54-V-M-1]  40.15 9.96 90 top
SW1  SK12D07VG4  [SW-TH_SK12D07VG4]  33.79 2.44 0 top
SW4  TS-1101-C-W  [SW-SMD_L6.0-W3.3-LS8.0]  22.62 17.71 0 top
U1  STM32F103C8T6  [LQFP-48_L7.0-W7.0-P0.50-LS9.0-BL]  21.61 29.77 135 top
U2  DHT11  [SENSOR-TH_DHT11]  5.35 29.64 270 top
U3  KH-2.54PH-1X4P-L13.5-WT  [HDR-SMD_4P-P2.54-H-M-W13.3-N]  8.53 8.05 0 top
U4  KH-2.54PH-1X4P-L13.5-WT  [HDR-SMD_4P-P2.54-H-M-W13.3-N]  8.53 8.05 180 bottom
U5  -  [定位孔]  38.58 66.29 0 top
U6  HS96L03W2C03  [OLED-TH_L27.8-W27.2-P2.54_C9900033791]  38.37 19.48 90 bottom
USART3  PZ254V-11-02P  [HDR-TH_2P-P2.54-V-M]  13.23 37.01 180 top
USB1  TYPE-C 16PIN 2MD(073)  [USB-C-SMD_TYPE-C-6PIN-2MD-073]  21.86 5 0 top
X1  32.768kHz  [FC-135R_L3.2-W1.5]  37.48 38.15 180 top
X2  8MHz  [CRYSTAL-SMD_L11.5-W4.8-LS12.7]  32.02 43.99 180 top

## Footprints (pads in the part's own frame, mm; a bottom-side part is the same pattern mirrored in y, then rotated)
C0603
  rect 0.8x0.9 smd: 1(-0.7,0) 2(0.7,0)
CRYSTAL-SMD_L11.5-W4.8-LS12.7
  rect 5.5x2 smd: 1(-4.45,0) 2(4.45,0)
FC-135R_L3.2-W1.5
  rect 1x1.8 smd: 1(-1.25,0) 2(1.25,0)
HDR-SMD_4P-P2.54-H-M-W13.3-N
  rect 1.02x3.16 smd: 1(-3.81,0) 2(-1.27,0) 3(1.27,0) 4(3.81,0)
HDR-TH_2P-P2.54-V-M
  rect 2x2 hole 1.2: 1(-1.27,0)
  round 2 hole 1.2: 2(1.27,0)
HDR-TH_3P-P2.54-V-M-1
  rect 1.575x1.8 hole 1.2: 1(-2.54,0)
  round 1.8 hole 1.2: 2(0,0) 3(2.54,0)
HDR-TH_6P-P2.54-V-M-R2-C3-S2.54
  rect 1.7x1.7 hole 1.1: 1(-2.54,-1.27)
  round 1.7 hole 1.1: 2(-2.54,1.27) 3(0,-1.27) 4(0,1.27) 5(2.54,-1.27) 6(2.54,1.27)
LED0603-RD
  rect 0.8x0.8 smd: 1(-0.799,0) 2(0.799,0)
LED0603-RD_RED
  rect 0.8x0.8 smd: 1(-0.799,-0.004) 2(0.799,0.004)
LQFP-48_L7.0-W7.0-P0.50-LS9.0-BL
  oval 0.27x1.5 smd: 1(-2.75,-4.25) 2(-2.25,-4.25) 3(-1.75,-4.25) 4(-1.25,-4.25) 5(-0.75,-4.25) 6(-0.25,-4.25) 7(0.25,-4.25) 8(0.75,-4.25) 9(1.25,-4.25) 10(1.75,-4.25) 11(2.25,-4.25) 12(2.75,-4.25) 25(2.75,4.25) 26(2.25,4.25) 27(1.75,4.25) 28(1.25,4.25) 29(0.75,4.25) 30(0.25,4.25) 31(-0.25,4.25) 32(-0.75,4.25) 33(-1.25,4.25) 34(-1.75,4.25) 35(-2.25,4.25) 36(-2.75,4.25)
  oval 1.5x0.27 smd: 13(4.25,-2.75) 14(4.25,-2.25) 15(4.25,-1.75) 16(4.25,-1.25) 17(4.25,-0.75) 18(4.25,-0.25) 19(4.25,0.25) 20(4.25,0.75) 21(4.25,1.25) 22(4.25,1.75) 23(4.25,2.25) 24(4.25,2.75) 37(-4.25,2.75) 38(-4.25,2.25) 39(-4.25,1.75) 40(-4.25,1.25) 41(-4.25,0.75) 42(-4.25,0.25) 43(-4.25,-0.25) 44(-4.25,-0.75) 45(-4.25,-1.25) 46(-4.25,-1.75) 47(-4.25,-2.25) 48(-4.25,-2.75)
OLED-TH_L27.8-W27.2-P2.54_C9900033791
  round 1.8 hole 1.05: 1(-3.81,0) 2(-1.27,0) 3(1.27,0) 4(3.81,0)
R0603
  rect 0.806x0.864 smd: 1(-0.753,0) 2(0.753,0)
R0805
  rect 1.133x1.377 smd: 1(-1,0) 2(1,0)
SENSOR-TH_DHT11
  rect 1.296x1.296 hole 0.711: 1(-3.81,0)
  round 1.296 hole 0.711: 2(-1.27,0) 3(1.27,0) 4(3.81,0)
SOT-23-5_L3.0-W1.7-P0.95-LS2.8-BL
  rect 0.49x1.157 smd: 1(-0.95,-1.153) 2(0,-1.153) 3(0.95,-1.153)
  rect 0.49x1.175 smd: 4(0.95,1.153) 5(-0.95,1.153)
SW-SMD_L6.0-W3.3-LS8.0
  rect 1.9x1.5 smd: 1(-4,0) 2(4,0)
SW-TH_SK12D07VG4
  round 1.524 hole 0.914: 1(-2,0) 2(0,0) 3(2,0)
  oval 1.4x2.2 hole 0.8x1.6: 4(4.15,0) 5(-4.15,0)
USB-C-SMD_TYPE-C-6PIN-2MD-073
  rect 0.55x1.5 smd: 1(-3.2,2.375) 2(-2.4,2.375) 11(2.4,2.375) 12(3.2,2.375)
  rect 0.3x1.5 smd: 3(-1.75,2.375) 4(-1.25,2.375) 5(-0.75,2.375) 6(-0.25,2.375) 7(0.25,2.375) 8(0.75,2.375) 9(1.25,2.375) 10(1.75,2.375)
  oval 1.1x2 hole 0.6x1.5: 13(-4.325,1.825) 14(4.325,1.825)
  oval 1.2x1.8 hole 0.6x1.2: 13(-4.325,-2.375) 14(4.325,-2.375)
WIFIM-SMD_ESP-12E-BR
  rect 1.3x2.5 smd: 1(-7.74,-7.75) 2(-5.74,-7.75) 3(-3.74,-7.75) 4(-1.74,-7.75) 5(0.26,-7.75) 6(2.26,-7.75) 7(4.26,-7.75) 8(6.26,-7.75) 15(6.26,7.75) 16(4.26,7.75) 17(2.26,7.75) 18(0.26,7.75) 19(-1.74,7.75) 20(-3.74,7.75) 21(-5.74,7.75) 22(-7.74,7.75)
  rect 1.8x1.3 smd: 9(7.74,-5.001) 10(7.739,-3.001) 11(7.739,-1.001) 12(7.739,0.999) 13(7.739,2.999) 14(7.74,4.999)
定位孔
  round 5 hole 3: 1(0,0)

## Nets
As in the schematic.

Pads without a net: LDO1 4; MK1 2 4 5 6 7 9 10 11 12 13 14 19 20; SW1 1; U1 10 14 15 16 17 18 19 26 27 28 29 38 39 40 41 43; U2 3; USB1 3 9 13 14

## Via types
v1: diameter 0.61, hole 0.305, Top Layer to Bottom Layer, 113 vias

## Routing (per net, layer and track width the routed paths; a pad name or vN(x,y) marks a point on that pad's centre or on a via; arc(x,y) is an arc through that point)
3.3V: length 184.8
  Top Layer w0.254: U2.1 7.38,31.42 13.99,31.42 14.69,32.12 ; U1.9 24.27,34.2 v1(24.27,35.1) 24.27,35.23 25.94,36.9 ; U1.36 v1(19.48,23.75) 18.67,22.95 18.67,22.9 ; 14.69,32.12 C11.2 ; 14.69,32.12 v1(14.75,32.06) 15.43,32.06 U1.24 ; U1.48 27.66,27.61 v1(27.7,27.61) 28.97,28.88 30.12,28.88 32.15,26.85 PC13.2 ; 28.99,27.34 28.21,28.12
  Top Layer w0.482: 33.85,11.29 34.97,11.29 P.2 ; 33.85,11.29 v1(33.85,13.91) ; 33.85,11.29 C4.2 C3.2 30.31,11.23 29.48,11.23 28.85,10.59 28.85,7.29 29.29,6.85 LDO1.5
  Top Layer w0.508: R24.1 12.09,41.73 12.09,43.36 ; R22.1 5.1,38.14 5.1,35.74 5.35,35.49 U2.1 ; R19.2 12.34,17.46 v1(12.34,15.93) ; 12.09,43.36 14.36,43.36 ; 12.09,43.36 8.04,43.36 ; 14.36,43.36 19.96,43.36 24.27,47.67 24.27,52.12 23.52,52.88 R23.2 ; 14.36,43.36 14.43,43.28 C14.2 ; 8.04,43.36 6.24,43.36 v1(5.45,44.15) 4.97,44.63 MK1.8 ; 8.04,43.36 8.04,41.61 R2.1 ; 12.21,8.18 U3.4 v1(12.34,10.1) v1(12.34,10.76) C15.2
  Bottom Layer w0.482: v1(33.85,13.91) v1(33.85,14.66) ; v1(24.27,35.1) 22.88,36.5 19.2,36.5 v1(14.75,32.06) 13.73,31.04 13.73,29.52 21.73,21.52 29.48,21.52
  Bottom Layer w0.508: U6.2 36.34,16.18 36.34,15.67 35.32,14.66 v1(33.85,14.66) 33.21,15.29 30.88,15.29 29.99,16.18 H1.1 H1.2 29.99,21.01 29.48,21.52 ; v1(5.1,37.85) v1(5.1,38.52) 5.1,43.8 v1(5.45,44.15) ; v1(12.34,15.93) v1(12.34,15.17) 12.34,14.6 ; 12.34,14.6 21.81,14.6 24.02,16.82 24.02,21.46 24.08,21.52 24.08,23.26 27.7,26.89 v1(27.7,27.61) ; 12.34,14.6 v1(12.34,10.76) v1(12.34,10.1) U3.4
5V_S: length 20.3
  Top Layer w0.482: C1.2 34.88,6.85 33.65,6.85 ; 33.65,6.85 LDO1.1 ; 33.65,6.85 33.67,6.87 33.67,8.43 33.36,8.75 LDO1.3
  Top Layer w0.508: SW1.2 35.47,4.12 36.47,4.12 37.43,5.08 37.43,5.67 ; 37.43,5.67 35.2,5.67 34.99,5.87 C1.2 ; 37.43,5.67 C2.2 38.13,6.96 38.63,7.46 38.63,8.69 39.9,9.96 SG90.2
+5V: length 25.1
  Top Layer w0.508: SW1.3 34.16,0.81 28.59,0.81 27.7,1.7 27.7,3.35 26.69,4.37 24.25,4.37 ; USB1.2 19.46,4.99 20.08,4.37 24.25,4.37 ; USB1.11 24.26,4.38 24.25,4.37
GND: length 96.9
  Top Layer w0.254: 15.13,33.07 17.01,31.19 U1.23 ; U1.35 21.11,26.09 21.23,26.09 ; 25.04,29.26 25.3,29.26 U1.47
  Top Layer w0.381: 17.16,8.31 18.18,8.31 18.66,7.82 ; 18.66,7.82 18.66,8.21 18.31,8.56 17.54,8.56 17.42,8.43 ; 18.66,7.82 USB1.1 18.66,5.87 18.56,5.77
  Top Layer w0.508: v1(28.72,37.39) v1(28.72,38.66) 29.24,39.18 C8.1 29.24,41.06 28.97,41.33 v1(28.03,41.33) v1(25.55,41.33) v1(24.02,42.85) v1(24.02,45.26) v1(25.26,46.5) v1(28.06,46.5) v1(31.96,46.5) v1(36.03,46.5) v1(38.78,46.5) v1(39.9,45.39) v1(39.9,42.47) v1(38.63,41.2) v1(36.55,41.2) 35.5,41.2 C7.1 34.51,39.5 v1(33.68,38.67) 31.76,36.76 31.01,36.76 v1(30.32,36.07) v1(29.1,34.85) v1(27.7,33.45) 27.2,33.45 v1(26.81,33.07) ; 26.43,8.56 25.55,8.56 25.06,8.08 USB1.12 25.06,5.87 25.16,5.77 ; v1(29.48,31.55) 30.5,32.56 v1(31.39,32.56) v1(33.93,32.56) v1(36.59,32.56) 37.1,32.56 37.55,33.01 C6.2 37.67,33.45 38.37,33.45 v1(39.77,34.85) v1(39.77,36.99) v1(39.77,38.79) 39.77,39.17 39.39,39.55 v1(38.38,39.55) v1(36.61,39.55) 35.58,39.55 v1(35.2,39.17) v1(35.2,37.01) 36.15,36.06 C5.2 35.89,35.61 v1(34.71,35.61) v1(33.28,35.61) v1(31.13,35.61)
  Bottom Layer w0.508: v1(38.53,33.61) 39.2,32.95 v1(39.26,32.95) ; v1(31.96,46.5) v1(31.96,47.68)
  vias: v1(5.1,20.25) v1(7.41,23.33) v1(9.29,20.25) v1(10.18,60.89) v1(10.18,55.81) v1(10.18,50.73) v1(10.18,35.49) v1(10.18,30.41) v1(10.18,25.33) v1(12.08,18.59) v1(15,35.23) v1(15.13,30.79) v1(15.26,60.89) v1(15.26,55.81) v1(15.26,50.73) v1(15.26,25.33) v1(15.26,10.09) v1(15.26,5) v1(17.68,21.91) v1(19.83,44.88) v1(20.34,30.41) v1(20.34,20.5) v1(20.46,5.39) v1(23,5.39) v1(25.42,65.97) v1(25.42,55.81) v1(25.42,50.73) v1(25.42,20.25) v1(25.42,15.17) v1(25.42,10.09) v1(27.2,39.17) v1(28.72,5.13) v1(30.5,65.97) v1(30.5,60.89) v1(30.5,55.81) v1(30.5,50.73) v1(30.5,25.07) v1(30.5,10.09) v1(31.96,36.96) v1(35.58,60.89) v1(35.58,55.81) v1(35.58,50.73) v1(35.58,10.09) v1(40.66,60.89) v1(40.66,25.33) v1(40.66,20.25) v1(40.66,15.17)
VBAT: length 10.8
  Top Layer w0.254: C16.1 34.75,30.28 29.1,30.28 28.08,31.29 27.02,31.29 U1.1
BOOT0: length 6
  Top Layer w0.254: R15.1 28.74,23.69 U1.44
PA1: length 25.2
  Top Layer w0.254: R5.2 24.16,56.69 24.78,56.06 24.78,47.42 22.75,45.39 22.75,36.5 23.64,35.61 23.64,34.98 U1.11
PA2: length 49.3
  Top Layer w0.254: v1(21.61,38.79) 22.24,38.15 22.24,36.37 23.13,35.49 23.13,35.18 U1.12
  Bottom Layer w0.254: v1(21.61,38.79) 21.48,38.91 10.56,38.91 7.38,35.74 7.38,24.94 5.73,23.29 5.73,17.71 5.44,17.41 5.44,12.55 4.72,11.83 U4.4
PA3: length 37.8
  Top Layer w0.254: v1(8.4,29.39) 8.78,29.77 17.42,29.77 21.24,33.6 21.24,34.02 U1.13
  Bottom Layer w0.254: v1(8.4,29.39) 8.4,12.84 7.26,11.7 U4.3
PA9: length 76.8
  Top Layer w0.254: v1(21.48,28.88) 20.85,28.25 19.73,28.25 U1.30 ; v1(32.28,25.83) 32.53,25.58 38.88,25.58 40.78,27.48 40.78,55.81 37.84,58.75 MK1.21
  Bottom Layer w0.254: v1(32.28,25.83) 27.32,30.79 23.39,30.79 v1(21.48,28.88)
PA10: length 78.8
  Top Layer w0.254: U1.31 19.48,27.29 21.03,27.29 v1(21.99,28.25) ; MK1.22 27.2,60.75 27.65,60.3 37.3,60.3 41.17,56.44 41.17,26.98 39.13,24.94 v1(32.02,24.94)
  Bottom Layer w0.254: v1(32.02,24.94) 26.81,30.15 23.89,30.15 v1(21.99,28.25)
PA11: length 21.3
  Top Layer w0.254: R3.1 18.24,13.83 18.11,13.97 ; R8.1 20.64,13.59 20.27,13.97 18.11,13.97 ; 18.11,13.97 17.36,14.71 16.35,14.71 15.88,15.18 15.88,15.54 16.65,16.31 16.65,16.56 16.27,16.94 15.51,16.94 15.26,17.2 15.26,22.36 U1.32
PA12: length 21.3
  Top Layer w0.254: R9.1 R6.1 22.8,13.97 22.37,14.4 19.45,14.4 15.89,17.96 15.89,22.29 U1.33
PA13: length 34.2
  Top Layer w0.254: 9.67,8.18 U3.3 9.92,8.18 9.92,11.7 9.67,11.95 9.67,19.36 9.92,19.61 14.5,19.61 14.83,19.28 14.83,16.23 v1(15.26,15.8) ; U1.34 16.53,22.22 v1(16.53,20.88)
  Bottom Layer w0.254: v1(16.53,20.88) 17.92,19.48 17.92,17.2 16.53,15.8 v1(15.26,15.8)
PA14: length 32.3
  Top Layer w0.254: v1(19.7,21.9) 21.86,21.9 23.51,23.55 23.51,23.98 U1.37 ; U3.2 7.13,8.18 7.13,19.61 8.65,21.13 v1(13.86,21.13)
  Bottom Layer w0.254: v1(19.7,21.9) 18.81,21.9 17.54,23.17 15.89,23.17 v1(13.86,21.13)
PB2: length 15.9
  Top Layer w0.254: U1.20 17.42,32.9 v1(17.42,33.58) ; R16.2 26.16,22.94 v1(24.4,24.69)
  Bottom Layer w0.254: v1(17.42,33.58) 17.42,31.68 v1(24.4,24.69)
PB8: length 15.7
  Top Layer w0.254: U6.3 36.85,20.75 34.82,22.79 30.36,22.79 U1.45
PB9: length 14.5
  Top Layer w0.254: U1.46 30.56,23.29 U6.4
PB12: length 21.5
  Top Layer w0.254: v1(6.62,36.12) 7.11,36.61 R22.2 ; U2.2 6.62,29.64 6.62,28.5 7.13,27.99 15.94,27.99 U1.25
  Bottom Layer w0.254: U2.2 6.62,32.18 v1(6.62,36.12)
PC13: length 10.5
  Top Layer w0.254: U1.2 26.72,31.7 28.31,31.7 29.1,30.91 35.97,30.91 R13.2
PWM: length 24.6
  Top Layer w0.254: U1.42 24.44,26.56 25.93,25.07 25.93,24.18 27.07,23.04 27.07,22.4 26.56,21.9 26.56,21.52 29.36,18.72 30.69,18.72 31.26,18.15 31.26,16.56 32.07,15.75 36.26,15.75 39.52,12.5 SG90.3
RESET: length 43.6
  Top Layer w0.254: R19.1 13.38,16.94 13.97,16.94 14.24,17.22 v1(14.24,17.71) ; C9.2 18.88,17.96 SW4.1 18.5,17.58 v1(17.16,17.58) ; v1(25.8,35.49) 25.04,34.72 25.04,33.55 U1.7
  Bottom Layer w0.254: v1(25.8,35.49) 23.51,37.77 18.62,37.77 12.34,31.48 12.34,19.61 v1(14.24,17.71) 17.04,17.71 v1(17.16,17.58)
USART3_RX: length 8
  Top Layer w0.254: USART3.2 11.96,36.63 12.84,35.74 13.42,35.74 16.53,32.63 16.53,32.38 U1.22
USART3_TX: length 6.5
  Top Layer w0.254: USART3.1 15.77,35.74 15.77,34.09 17.02,32.83 17.02,32.59 U1.21
$1N1630: length 19.4
  Top Layer w0.508: MK1.3 4.14,56.75 2.81,55.42 2.81,43.23 4.59,41.45 6.38,41.45 R2.2
$1N3315: length 17.5
  Top Layer w0.254: X1.2 36.23,37.12 36.47,36.88 37.23,36.88 37.55,36.56 C5.1 37.55,35.3 37.23,34.98 36.34,34.98 35.83,34.47 34.82,34.47 34.31,34.98 33.17,34.98 32.66,34.47 32.02,34.47 31.51,34.98 30.62,34.98 28.11,32.46 26.08,32.46 25.94,32.33
$1N3359: length 17.8
  Top Layer w0.254: X1.1 38.73,34.96 38.24,34.47 36.59,34.47 36.21,34.09 36.21,33.65 C6.1 30.62,33.58 29.1,32.06 26.37,32.06 U1.3
$1N3671: length 16.7
  Top Layer w0.254: U1.5 26.99,34.09 27.41,34.09 R17.1 33.11,39.79 C7.2 36.47,43.57 X2.1
$1N3708: length 16.5
  Top Layer w0.254: U1.6 29.94,37.75 R17.2 29.94,38.48 30.64,39.18 C8.2 30.64,41.95 30.24,42.34 27.83,42.34 27.57,42.6 X2.2
$1N7553: length 5.3
  Top Layer w0.254: R3.2 18.42,11.37 21.1,8.69 21.1,7.39 USB1.5
$1N7577: length 8.7
  Top Layer w0.254: R6.2 22.05,12.12 20.08,12.12 19.7,11.74 19.7,10.85 21.61,8.94 USB1.6
$1N7601: length 4.6
  Top Layer w0.254: USB1.7 22.11,9.89 R8.2
$1N7625: length 5
  Top Layer w0.254: USB1.8 22.61,8.3 25.04,10.72 25.04,11.35 R9.2
$1N15087: length 2.4
  Top Layer w0.482: P.1 35.11,12.74 R11.1
$1N15121: length 5.9
  Top Layer w0.254: R13.1 38.12,31.04 38.88,30.28 38.88,27.48 38.24,26.85 PC13.1
$1N18837: length 7
  Top Layer w0.254: USB1.10 23.61,8.43 24.63,9.45 26.94,9.45 27.45,9.96 27.45,11.28 R10.2
$1N26698: length 2.9
  Top Layer w0.254: MK1.16 20.9,48.75 21.86,49.71 23,49.71 R7.1
$1N35712: length 7.5
  Top Layer w0.254: R4.2 16.01,10.22 16.78,9.45 19.58,9.45 20.61,8.41 USB1.4
$1N52179: length 3.9
  Top Layer w0.254: MK1.18 21.22,52.75 23,54.54 R5.1
$1N52203: length 2.8
  Top Layer w0.254: MK1.17 21.09,51.37 R23.1
$1N63834: length 30.6
  Top Layer w0.508: R24.2 9.17,40.31 4.08,40.31 2.05,42.34 2.05,59.62 3.19,60.75 MK1.1
$1N65356: length 7.5
  Top Layer w0.254: R16.1 27.83,23.34 27.83,22.56 28.75,21.64 30.75,21.64 H1.4
$1N65358: length 7.5
  Top Layer w0.254: H1.3 32.53,17.96 31.13,19.36 31.13,20.37 30.37,21.13 28.29,21.13 27.81,21.62

## Copper pours and planes (outline as drawn; the poured copper is in the pictures)
GND on Top Layer: -0.62,70.03 42.82,70.03 42.82,-0.84 -0.62,-0.84
GND on Bottom Layer: -1.89,69.9 42.18,69.9 42.18,-2.36 -1.89,-2.36

Small or netless copper shapes (teardrops, artwork), in the pictures only: 180 on Top Layer, 30 on Bottom Layer

## Text on the board
Bottom Silkscreen Layer: TX | RX | G | 3.3
Top Silkscreen Layer: RX3 | TX3 | B1 | B0 | GND | G | CLK | DIO | 3.3
